# EasyEDA Pro project ProPrj_KrabbyUno - v0.2_2026-05-19.epro, board PCB1
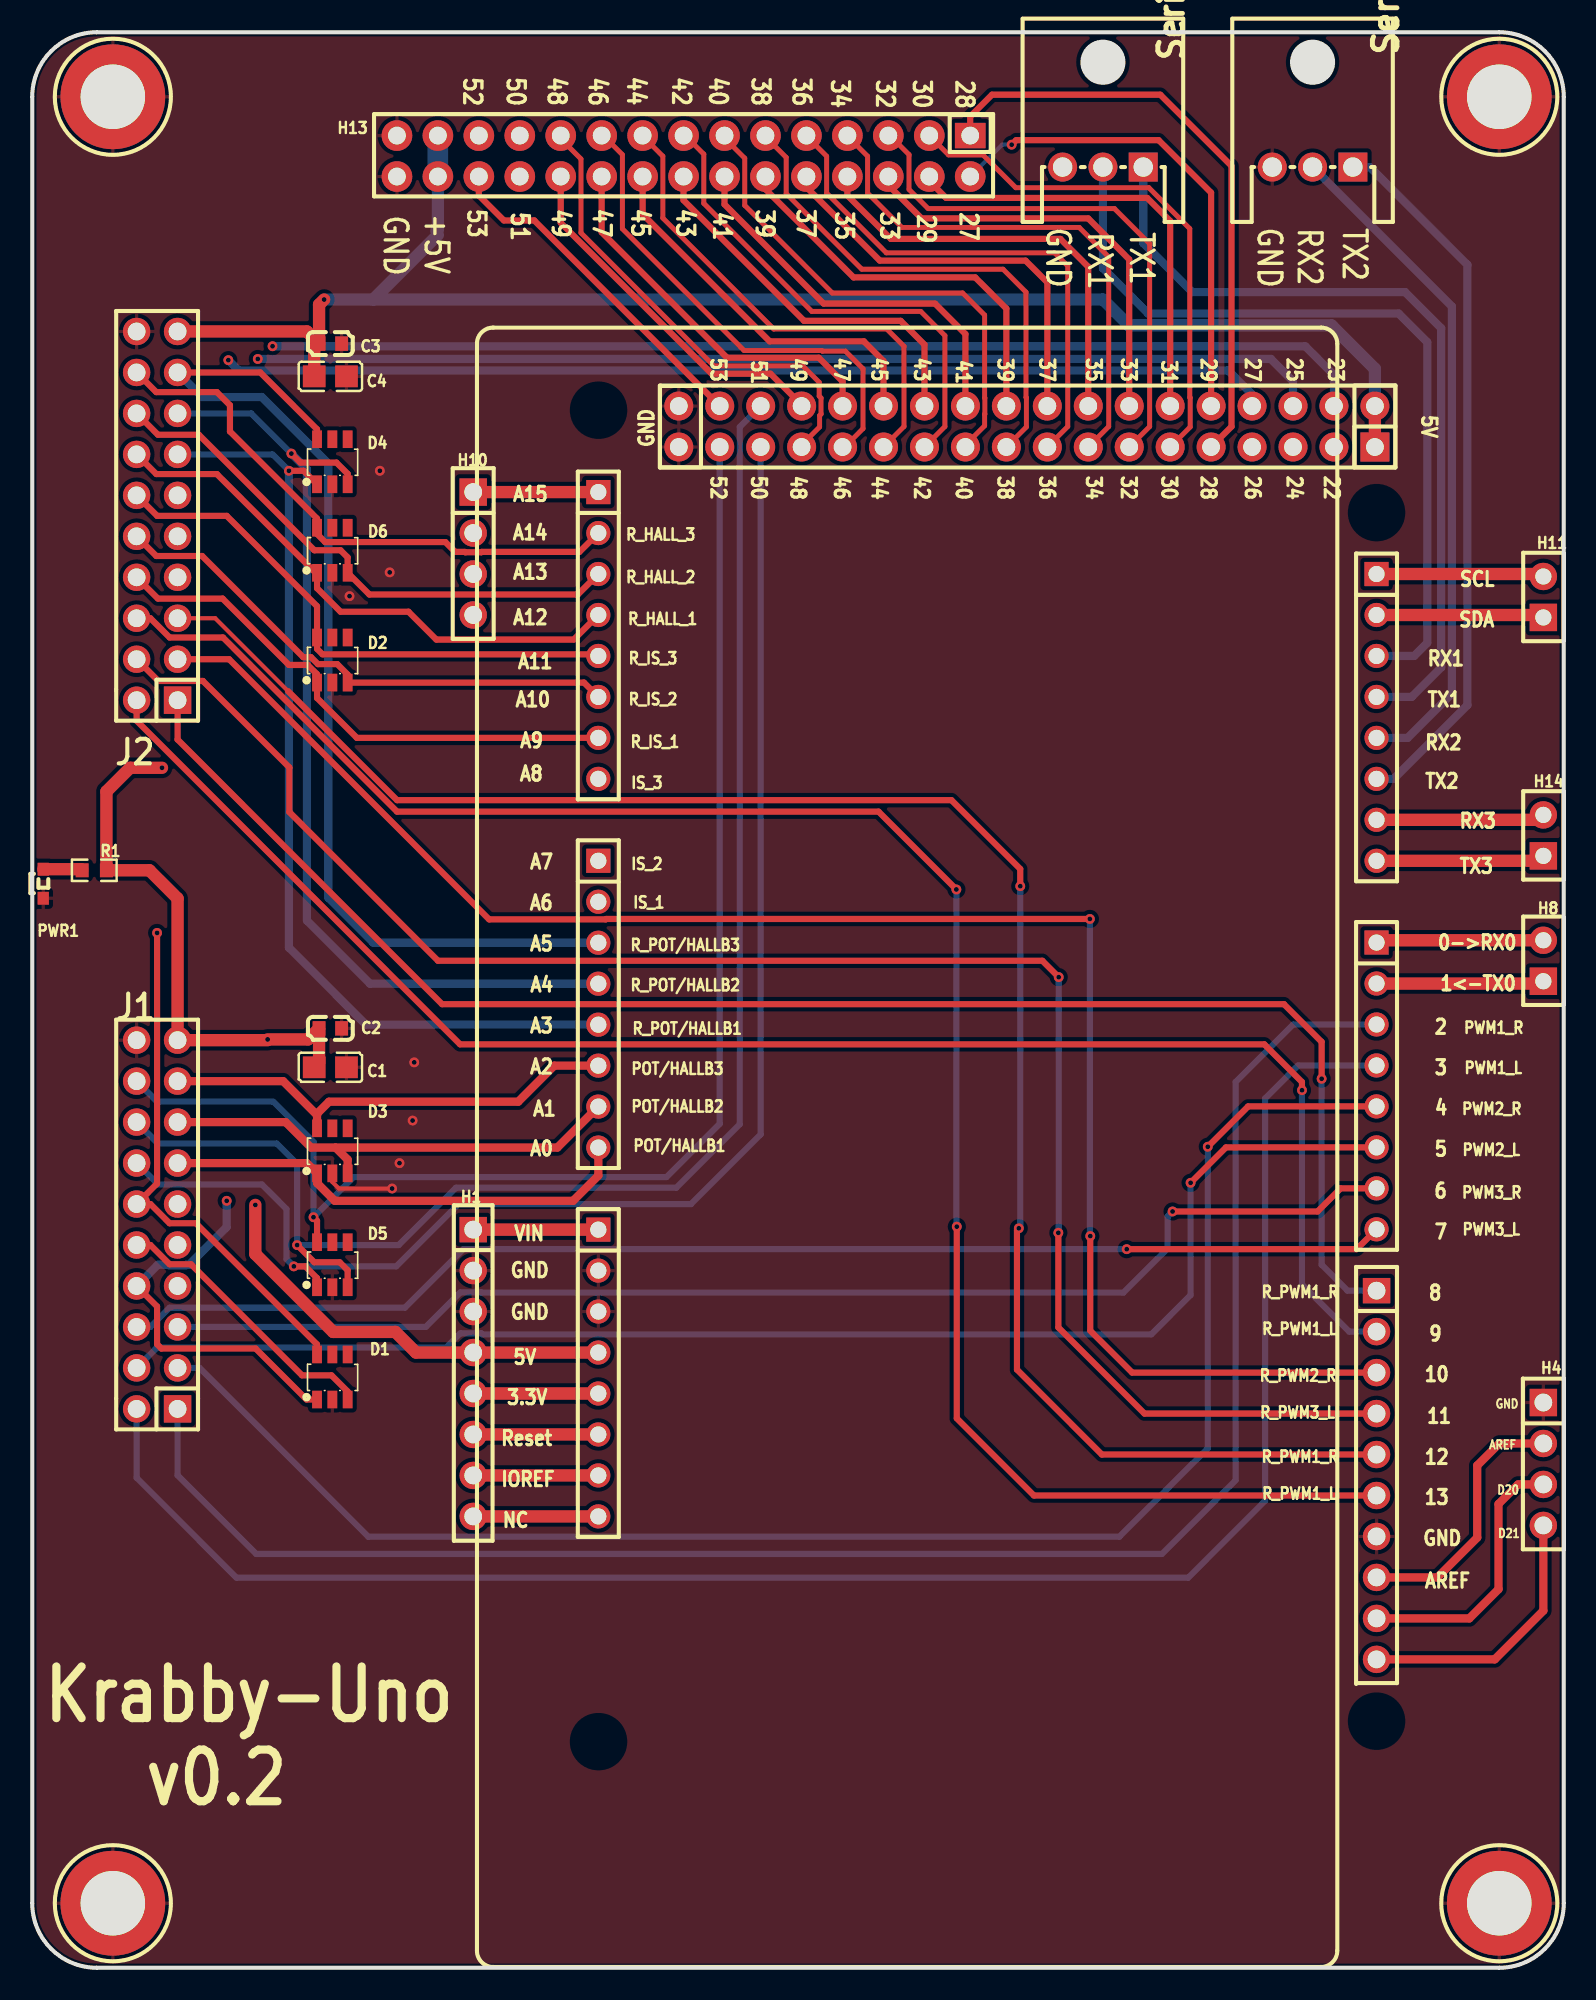
[diagram p6: board, top side]
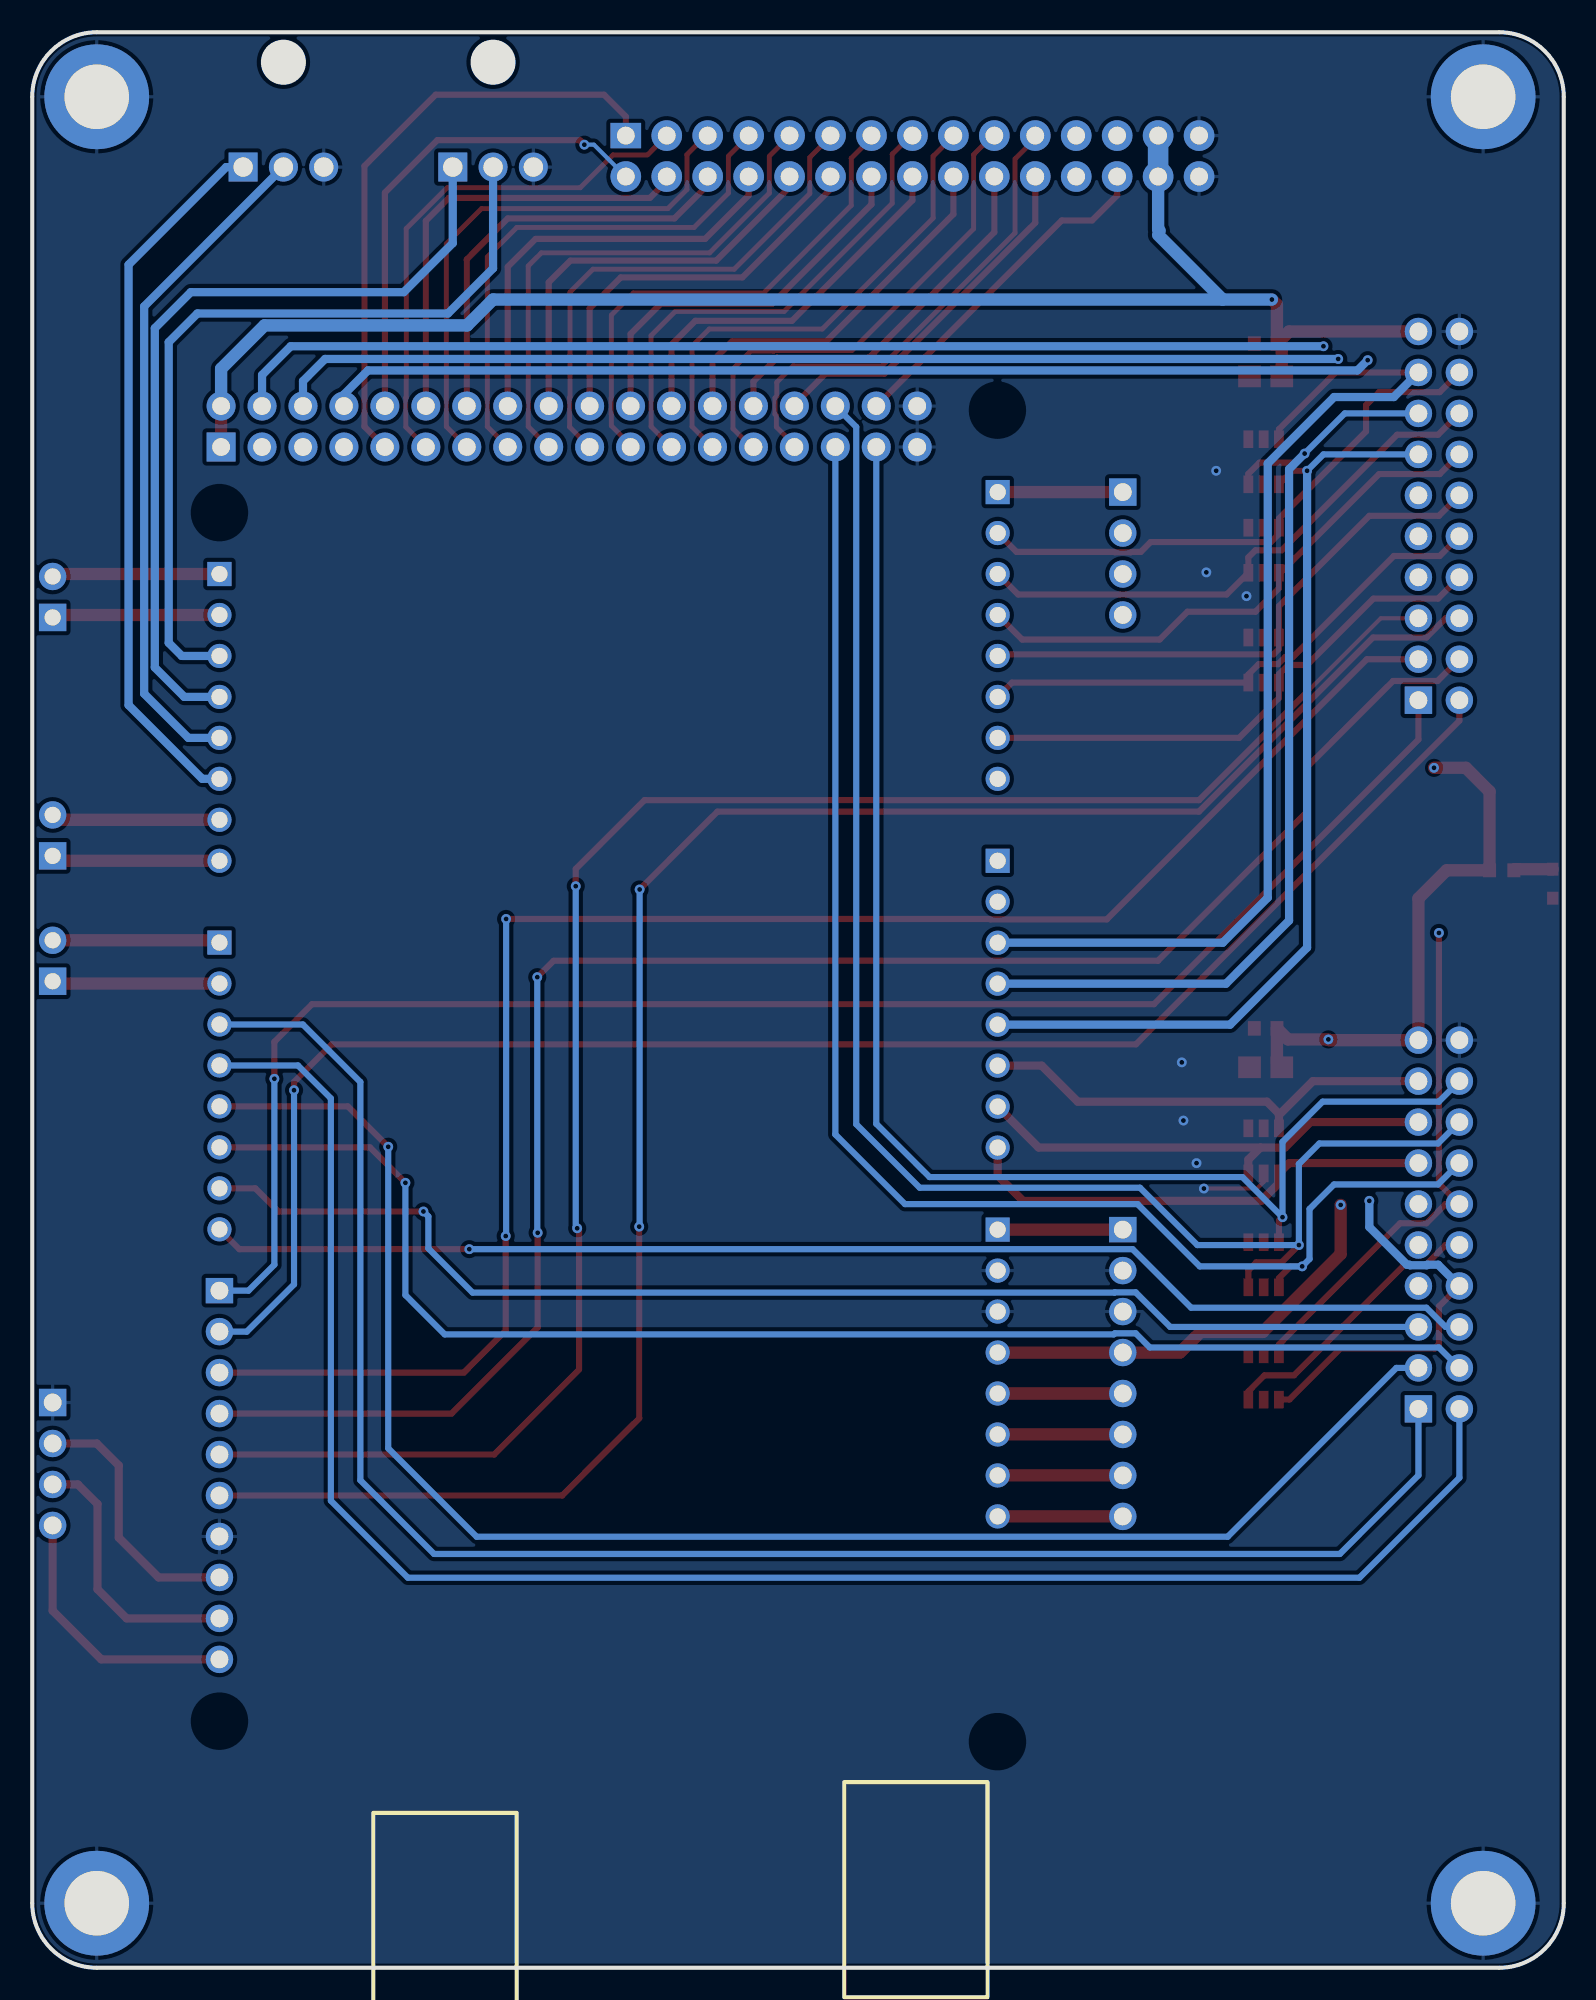
[diagram p7: board, bottom side, seen from below]

Outline 95 x 120 mm; copper layers: Top Layer, Inner1, Inner2, Bottom Layer. Coordinates in mm from the lower left corner of the outline.
Outline path: 0,116 0,4 arc(1.17,1.17) 4,0 91,0 arc(93.83,1.17) 95,4 95,116 arc(93.83,118.83) 91,120 4,120 arc(1.17,118.83) 0,116
Stack: Top Layer 0.035mm Outer layer thickness 1oz / Dielectric1 0.2104mm 7628 RC49% 8.6mil / Inner1 0.0152mm Inner layer thickness / Dielectric2 1.065mm 1.1mm H/HOZ Copper / Inner2 0.0152mm Inner layer thickness / Dielectric3 0.2104mm 7628 RC49% 8.6mil / Bottom Layer 0.035mm Outer layer thickness 1oz

## Design rules (mm)
template: JLCPCB Capability(Two Layers Board)
spacing copperThickness1oz (default): track to track 0.102, other pairs 0.152 to 0.3
spacing copperThickness2oz: track to track 0.203, other pairs 0.152 to 0.3
track width copperThickness1oz (default): min 0.127, default 0.254, max 2.54
track width copperThickness2oz: min 0.203, default 0.254, max 2.54
differential pair differentialPair (default): width min 0.127, default 0.254, max 2.54; gap min 0.152, default 0.152
via viaSize (default): diameter min 0.5, default 0.61, max 10; hole min 0.3, default 0.305, max 6.3

## Placement (name value [footprint] x y rotation side)
C1  4.7uF  [C0805]  18.49 55.83 180 top
C2  100nF  [C0603]  18.49 58.24 0 top
C3  100nF  [C0603]  18.49 100.7 0 top
C4  4.7uF  [C0805]  18.49 98.67 180 top
D1  PESD5V0S5UD,115  [SC-74-6_L3.0-W1.5-P0.95-LS2.8-BL]  18.62 36.63 0 top
D2  PESD5V0S5UD,115  [SC-74-6_L3.0-W1.5-P0.95-LS2.8-BL]  18.62 81.08 0 top
D3  PESD5V0S5UD,115  [SC-74-6_L3.0-W1.5-P0.95-LS2.8-BL]  18.62 50.65 0 top
D4  PESD5V0S5UD,115  [SC-74-6_L3.0-W1.5-P0.95-LS2.8-BL]  18.62 93.37 0 top
D5  PESD5V0S5UD,115  [SC-74-6_L3.0-W1.5-P0.95-LS2.8-BL]  18.62 43.59 0 top
D6  PESD5V0S5UD,115  [SC-74-6_L3.0-W1.5-P0.95-LS2.8-BL]  18.62 87.88 0 top
H1  PM254-1-08-Z-8.5  [HDR-TH_8P-P2.54-V-F]  27.35 36.87 270 top
H2  PZ254V-11-08P  [HDR-TH_8P-P2.54-V-M]  35.11 36.87 270 top
H3  PZ254V-11-10P  [HDR-TH_10P-P2.54-V-M]  83.39 30.55 270 top
H4  PM254-1-04-Z-8.5  [HDR-TH_4P-P2.54-V-F]  93.73 31.23 270 top
H5  PZ254V-11-08P  [HDR-TH_8P-P2.54-V-M]  35.11 59.74 270 top
H6  PZ254V-11-08P  [HDR-TH_8P-P2.54-V-M]  83.39 54.67 270 top
H7  PZ254V-11-08P  [HDR-TH_8P-P2.54-V-M]  35.11 82.6 270 top
H8  PM254-1-02-Z-8.5  [HDR-TH_2P-P2.54-V-F]  93.73 62.43 90 top
H9  PZ254V-11-08P  [HDR-TH_8P-P2.54-V-M]  83.39 77.52 270 top
H10  PM254-1-04-Z-8.5  [HDR-TH_4P-P2.54-V-F]  27.35 87.68 270 top
H11  PM254-1-02-Z-8.5  [HDR-TH_2P-P2.54-V-F]  93.73 84.99 90 top
H12  PZ254-2-18-Z-8.5  [HDR-TH_36P-P2.54-V-M-R2-C18-S2.54]  61.69 95.56 0 top
H13  HC-PM254-8.5H-2x15PZ  [HDR-TH_30P-P2.54-V-F-R2-C15-S2.54]  40.4 112.32 180 top
H14  PM254-1-02-Z-8.5  [HDR-TH_2P-P2.54-V-F]  93.73 70.21 90 top
J1  PZ254V-12-20P  [HDR-TH_20P-P2.54-V-M-R2-C10-S2.54]  7.75 46.08 90 top
J2  PZ254V-12-20P  [HDR-TH_20P-P2.54-V-M-R2-C10-S2.54]  7.75 90.02 90 top
M1  SMTSO2025CTJ  [SMD-1_BD6.2-D3.6]  5 116 270 top
M2  SMTSO2025CTJ  [SMD-1_BD6.2-D3.6]  5 4 270 top
M3  SMTSO2025CTJ  [SMD-1_BD6.2-D3.6]  91 116 270 top
M4  SMTSO2025CTJ  [SMD-1_BD6.2-D3.6]  91 4 270 top
PWR1  LTST-S270TGKT  [LED-SMD_L1.7-W0.6-RD_GREEN]  0.68 67.21 90 top
R1  4.7K  [R0603]  3.85 68.04 180 top
Serial_1  S03B-XASK-1(LF)(SN)  [CONN-TH_S03B-XASK-1]  66.41 111.64 180 top
Serial_2  S03B-XASK-1(LF)(SN)  [CONN-TH_S03B-XASK-1]  79.42 111.64 180 top

## Footprints (pads in the part's own frame, mm; a bottom-side part is the same pattern mirrored in y, then rotated)
C0603
  rect 0.8x0.9 smd: 1(-0.7,0) 2(0.7,0)
C0805
  rect 1.41x1.35 smd: 1(-1,0) 2(1,0)
CONN-TH_S03B-XASK-1
  rect 1.8x1.8 hole 1.2: 1(-2.5,0)
  round 1.8 hole 1.2: 2(0,0) 3(2.5,0)
HDR-TH_2P-P2.54-V-F
  rect 1.7x1.7 hole 1: 1(-1.27,0)
  round 1.7 hole 1: 2(1.27,0)
HDR-TH_4P-P2.54-V-F
  rect 1.7x1.7 hole 1.1: 1(-3.81,0)
  round 1.7 hole 1.1: 2(-1.27,0) 3(1.27,0) 4(3.81,0)
HDR-TH_8P-P2.54-V-F
  rect 1.575x1.7 hole 1.1: 1(-8.89,0)
  round 1.7 hole 1.1: 2(-6.35,0) 3(-3.81,0) 4(-1.27,0) 5(1.27,0) 6(3.81,0) 7(6.35,0) 8(8.89,0)
HDR-TH_8P-P2.54-V-M
  rect 1.5x1.5 hole 1: 1(-8.89,0)
  round 1.5 hole 1: 2(-6.35,0) 3(-3.81,0) 4(-1.27,0) 5(1.27,0) 6(3.81,0) 7(6.35,0) 8(8.89,0)
HDR-TH_10P-P2.54-V-M
  rect 1.575x1.7 hole 1.1: 1(-11.43,0)
  round 1.7 hole 1.1: 2(-8.89,0) 3(-6.35,0) 4(-3.81,0) 5(-1.27,0) 6(1.27,0) 7(3.81,0) 8(6.35,0) 9(8.89,0) 10(11.43,0)
HDR-TH_20P-P2.54-V-M-R2-C10-S2.54
  rect 1.7x1.7 hole 1.1: 1(-11.43,-1.27)
  round 1.7 hole 1.1: 2(-11.43,1.27) 3(-8.89,-1.27) 4(-8.89,1.27) 5(-6.35,-1.27) 6(-6.35,1.27) 7(-3.81,-1.27) 8(-3.81,1.27) 9(-1.27,-1.27) 10(-1.27,1.27) 11(1.27,-1.27) 12(1.27,1.27) 13(3.81,-1.27) 14(3.81,1.27) 15(6.35,-1.27) 16(6.35,1.27) 17(8.89,-1.27) 18(8.89,1.27) 19(11.43,-1.27) 20(11.43,1.27)
HDR-TH_30P-P2.54-V-F-R2-C15-S2.54
  rect 1.9x1.575 hole 1.1: 1(-17.78,-1.27)
  round 1.9 hole 1.1: 2(-17.78,1.27) 3(-15.24,-1.27) 4(-15.24,1.27) 5(-12.7,-1.27) 6(-12.7,1.27) 7(-10.16,-1.27) 8(-10.16,1.27) 9(-7.62,-1.27) 10(-7.62,1.27) 11(-5.08,-1.27) 12(-5.08,1.27) 13(-2.54,-1.27) 14(-2.54,1.27) 15(0,-1.27) 16(0,1.27) 17(2.54,-1.27) 18(2.54,1.27) 19(5.08,-1.27) 20(5.08,1.27) 21(7.62,-1.27) 22(7.62,1.27) 23(10.16,-1.27) 24(10.16,1.27) 25(12.7,-1.27) 26(12.7,1.27) 27(15.24,-1.27) 28(15.24,1.27) 29(17.78,-1.27) 30(17.78,1.27)
HDR-TH_36P-P2.54-V-M-R2-C18-S2.54
  rect 1.8x1.8 hole 1.1: 1(21.59,-1.27)
  round 1.8 hole 1.1: 2(21.59,1.27) 3(19.05,-1.27) 4(19.05,1.27) 5(16.51,-1.27) 6(16.51,1.27) 7(13.97,-1.27) 8(13.97,1.27) 9(11.43,-1.27) 10(11.43,1.27) 11(8.89,-1.27) 12(8.89,1.27) 13(6.35,-1.27) 14(6.35,1.27) 15(3.81,-1.27) 16(3.81,1.27) 17(1.27,-1.27) 18(1.27,1.27) 19(-1.27,-1.27) 20(-1.27,1.27) 21(-3.81,-1.27) 22(-3.81,1.27) 23(-6.35,-1.27) 24(-6.35,1.27) 25(-8.89,-1.27) 26(-8.89,1.27) 27(-11.43,-1.27) 28(-11.43,1.27) 29(-13.97,-1.27) 30(-13.97,1.27) 31(-16.51,-1.27) 32(-16.51,1.27) 33(-19.05,-1.27) 34(-19.05,1.27) 35(-21.59,-1.27) 36(-21.59,1.27)
LED-SMD_L1.7-W0.6-RD_GREEN
  rect 0.8x0.7 smd: 1(-0.9,0) 2(0.9,0)
R0603
  rect 0.806x0.864 smd: 1(-0.753,0) 2(0.753,0)
SC-74-6_L3.0-W1.5-P0.95-LS2.8-BL
  rect 0.61x1.092 smd: 1(-0.95,-1.397) 2(0,-1.397) 3(0.95,-1.397) 4(0.95,1.397) 5(0,1.397) 6(-0.95,1.397)
SMD-1_BD6.2-D3.6
  round 6.5 hole 4: 1(0,0)

## Nets
As in the schematic.

Pads without a net: D1 4 5; D2 4 5; D3 4 5; D4 4 5; D5 4 5; D6 4 5; H10 2 3 4; H13 23 24 25

## Via types
v1: diameter 0.61, hole 0.305, Top Layer to Bottom Layer, 36 vias

## Routing (per net, layer and track width the routed paths; a pad name or vN(x,y) marks a point on that pad's centre or on a via; arc(x,y) is an arc through that point)
+5V: length 206.6
  Top Layer w0.762: J2.19 17.04,101.45 C3.1 ; H12.1 H12.2 ; v1(8.05,74.4) 6.07,74.4 4.6,72.93 R1.1 7.27,68.04 9.02,66.3 J1.19 14.6,57.51 ; C3.1 17.49,100.4 C4.2 ; C3.1 17.79,103.11 v1(18.11,103.43) ; C1.2 17.79,56.13 C2.1 17.11,57.56 v1(14.6,57.56) ; v1(13.84,47.3) 13.84,44.25 18.67,39.42 22.53,39.42 23.8,38.14 H1.4 H2.4
  Inner2 w0.762: v1(18.11,103.43) 17.19,102.51 17.19,76.71 15.47,74.98 8.63,74.98 v1(8.05,74.4) ; v1(14.6,57.56) 13.84,56.79 v1(13.84,47.3)
  Bottom Layer w0.762: 21.15,103.43 25.16,107.44 ; 21.15,103.43 v1(18.11,103.43) ; 21.15,103.43 66.42,103.43 68.02,101.83 80.59,101.83 83.28,99.13 H12.2 ; H13.28 25.16,107.79 25.07,107.7
  Bottom Layer w1.27: H13.28 H13.27
GND: length 4.4
  Top Layer w0.254: v1(22.32,48.31) 19.02,48.31 18.62,48.72 18.62,49.25
  vias: v1(19.68,85.04) v1(21.56,92.81) v1(22.17,86.51) v1(22.78,49.89) v1(23.59,52.53) v1(23.69,56.13)
AREF: length 16.4
  Top Layer w0.508: H4.2 91,32.5 89.63,31.14 89.63,26.67 87.16,24.2 H3.8
D20: length 16.9
  Top Layer w0.508: H3.9 89.14,21.66 90.95,23.47 90.95,28.75 92.16,29.96 H4.3
D21: length 16.9
  Top Layer w0.508: H4.4 93.73,22.14 90.72,19.12 H3.10
EN1: length 113.4
  Inner2 w0.381: H12.3 80.75,59.87 68.17,47.3 26.39,47.3 21.36,42.27 J1.7
EN2: length 111.3
  Inner2 w0.381: H12.5 78.21,60.12 66.39,48.31 26.03,48.31 20.55,42.82 11,42.82 J1.9
EN3: length 107.5
  Inner2 w0.381: H12.7 75.97,93.98 75.97,60.55 64.33,48.92 25.62,48.92 24.05,47.35 16.63,47.35 15.21,45.92 10.44,45.92 J1.11
HALLA1: length 91.5
  Top Layer w0.381: D5.1 17.67,42.76 16.94,43.48 v1(16.23,43.48)
  Bottom Layer w0.381: H12.31 45.19,51.67 40.87,47.35 26.44,47.35 22.58,43.48 v1(16.23,43.48) 15.77,43.94 15.77,47.04 14.25,48.56 7.8,48.56 J1.14
HALLA2: length 96.5
  Top Layer w0.381: D5.3 19.57,43.24 19.07,43.74 17.5,43.74 v1(16.43,44.81)
  Bottom Layer w0.381: H12.32 43.89,95.53 43.89,52.3 39.95,48.36 26.28,48.36 22.73,44.81 v1(16.43,44.81) 16.43,49.83 15.16,51.11 7.8,51.11 J1.16
HALLA3: length 88.4
  Top Layer w0.381: D5.6 17.67,46.31 v1(17.45,46.53)
  Bottom Layer w0.381: H12.33 42.65,52.33 39.34,49.02 19.94,49.02 v1(17.45,46.53) 17.45,51.21 14.96,53.7 7.75,53.7 J1.18
IS1: length 64
  Top Layer w0.381: J1.8 7.74,41 7.74,38.66 8.01,38.39 13.85,38.39 17.01,35.23 D1.1
  Inner2 w0.508: v1(12.06,47.55) 12.06,62.99 15.16,66.09 H5.2
  Bottom Layer w0.508: v1(12.06,47.55) 12.06,45.92 9.72,43.59 9.57,43.59 9.53,43.55 8.49,43.55 8.46,43.59 7.79,43.59 J1.8
IS2: length 65.6
  Top Layer w0.381: J1.10 7.33,44.81 8.52,43.62 9.85,43.62 16.73,36.73 18.56,36.73 19.57,35.73 D1.3
  Inner2 w0.508: J1.10 7.74,46.08 7.74,62.69 13.69,68.63 H5.1
IS3: length 67.9
  Top Layer w0.381: D1.6 17.67,38.64 10.15,46.16 8.52,46.16 7.33,47.35 J1.12 7.74,48.62 v1(7.74,64.16)
  Inner2 w0.508: v1(7.74,64.16) 7.74,70.66 10.79,73.71 H7.8
POT/HALLB1: length 29.8
  Top Layer w0.508: J1.13 17.03,49.89 17.67,49.25 17.67,48.65 18.77,47.55 33.55,47.55 35.11,49.11 H5.8
POT/HALLB2: length 29.7
  Top Layer w0.508: H5.7 32.57,50.85 18.82,50.85 ; 18.82,50.85 17.29,50.85 15.72,52.43 J1.15 ; 18.82,50.85 19.57,50.1 19.57,49.25
POT/HALLB3: length 29.1
  Top Layer w0.508: H5.6 32.38,55.93 30.15,53.7 18.41,53.7 17.67,52.95 17.67,52.87 ; 17.67,52.87 15.56,54.97 J1.17 ; 17.67,52.87 D3.6
PWM1_L: length 111.5
  Bottom Layer w0.381: J1.2 6.47,30.38 12.67,24.18 71.7,24.18 76.48,28.96 76.48,53.9 78.52,55.94 H6.4
PWM1_R: length 108.6
  Bottom Layer w0.381: H6.3 78.21,58.48 74.65,54.92 74.65,30.23 70.07,25.65 13.89,25.65 9.02,30.53 J1.1
PWM2_L: length 86.7
  Top Layer w0.381: H6.6 74.05,50.86 v1(71.85,48.67)
  Bottom Layer w0.381: J1.4 7.74,38.46 25.68,38.46 26.56,39.34 27.85,39.34 27.91,39.27 69.41,39.27 71.85,41.71 v1(71.85,48.67)
PWM2_R: length 100.7
  Top Layer w0.381: H6.5 75.42,53.4 v1(72.92,50.9)
  Bottom Layer w0.381: v1(72.92,50.9) 72.92,32.21 67.43,26.72 20.85,26.72 10.38,37.19 J1.3
PWM3_L: length 79.4
  Top Layer w0.381: v1(67.89,44.55) 82.16,44.55 H6.8
  Bottom Layer w0.381: J1.6 7.33,39.73 8.52,40.92 23.11,40.92 26.74,44.55 v1(67.89,44.55)
PWM3_R: length 79.1
  Top Layer w0.381: H6.7 81.16,48.32 79.73,46.89 v1(70.74,46.89)
  Bottom Layer w0.381: J1.5 24.41,39.73 26.56,41.88 27.85,41.88 27.86,41.86 67.69,41.86 70.43,44.6 70.43,46.58 v1(70.74,46.89)
R_EN1: length 87.4
  Inner2 w0.508: v1(14.91,100.53) 14.91,88.54 12.57,86.21 J2.7
  Bottom Layer w0.508: H12.4 80.75,98.75 78.97,100.53 v1(14.91,100.53)
R_EN2: length 81.3
  Inner2 w0.508: J2.9 12.32,88.75 13.99,90.42 v1(13.99,99.75)
  Bottom Layer w0.508: H12.6 78.21,98.37 76.83,99.75 v1(13.99,99.75)
R_EN3: length 76.1
  Inner2 w0.508: J2.11 11.25,91.29 12.16,92.2 v1(12.16,99.67)
  Bottom Layer w0.508: H12.8 75.66,97.54 74.18,99.03 12.8,99.03 v1(12.16,99.67)
R_HALLA1: length 34.6
  Top Layer w0.381: J2.14 7.69,92.61 11.45,92.61 17.57,86.49 D6.1 17.67,85.53 19.12,84.07 23.34,84.07 25.07,82.35 33.59,82.35 H7.4
R_HALLA2: length 34.4
  Top Layer w0.381: J2.16 7.8,95.05 10.33,95.05 17.5,87.88 19.12,87.88 19.57,87.44 D6.3 20.91,85.14 33.84,85.14 H7.3
R_HALLA3: length 35.3
  Top Layer w0.381: H7.2 33.94,87.78 27.87,87.78 27.85,87.76 26.86,87.76 26.84,87.78 26.23,87.78 25.62,88.39 18.17,88.39 17.67,88.9 D6.6 17.67,89.85 12.26,95.25 12.26,96.88 11.45,97.69 7.69,97.69 J2.18
R_IS1: length 33.6
  Top Layer w0.381: H7.7 20.14,76.25 17.67,78.72 D2.1 17.67,80.2 17.09,80.77 15.92,80.77 11.81,84.89 7.8,84.89 J2.8
R_IS2: length 33.1
  Top Layer w0.381: H7.6 34.22,79.68 D2.3 19.57,80.18 18.92,80.82 17.72,80.82 17.29,81.25 16.81,81.25 10.54,87.53 7.69,87.53 J2.10
R_IS3: length 34.3
  Top Layer w0.381: H7.5 35.01,81.43 18,81.43 17.67,81.77 D2.6 17.67,84.41 12.06,90.02 7.75,90.02 J2.12
R_POT/HALLB1: length 60.2
  Top Layer w0.381: D4.1 16.83,92.81 v1(15.92,92.81)
  Bottom Layer w0.381: J2.13 14.91,93.83 v1(15.92,92.81)
  Bottom Layer w0.508: H5.5 20.7,58.47 15.92,63.25 v1(15.92,92.81)
R_POT/HALLB2: length 61.8
  Top Layer w0.381: v1(16.07,93.88) 16.63,93.32 18.87,93.32 19.57,92.62 D4.3
  Bottom Layer w0.381: v1(16.07,93.88) 13.58,96.37 J2.15
  Bottom Layer w0.508: H5.4 20.95,61.01 17.04,64.92 17.04,92.91 v1(16.07,93.88)
R_POT/HALLB3: length 67.2
  Top Layer w0.381: J2.17 14.14,98.91 17.67,95.39 D4.6
  Bottom Layer w0.508: J2.17 10.54,97.38 14.25,97.38 18.36,93.27 18.36,66.34 21.15,63.55 H5.3
R_PWM1_L: length 101.2
  Top Layer w0.381: J2.2 6.47,77.32 26.54,57.25 76.43,57.25 78.76,54.92 v1(78.76,54.41)
  Bottom Layer w0.381: v1(78.76,54.41) 78.76,42.37 81.69,39.44 H3.2
R_PWM1_R: length 99.1
  Top Layer w0.381: v1(79.98,55.12) 79.98,57.4 77.64,59.74 25.42,59.74 9.02,76.15 J2.1
  Bottom Layer w0.381: H3.1 81.59,41.98 79.98,43.59 v1(79.98,55.12)
R_PWM2_L: length 110.7
  Top Layer w0.381: J2.4 7.82,79.78 10.59,79.78 15.95,74.42 15.95,71.66 25.17,62.43 62.66,62.43 v1(63.67,61.42) ; v1(63.65,45.57) 63.65,39.7 68.99,34.36 H3.4
  Bottom Layer w0.381: v1(63.67,61.42) 63.67,45.59 v1(63.65,45.57)
R_PWM2_R: length 107.7
  Top Layer w0.381: J2.3 12.21,81.13 28.34,65 35.57,65 35.59,65.02 v1(65.6,65.02) ; v1(65.63,45.36) 65.63,39.5 68.23,36.9 H3.3
  Bottom Layer w0.381: v1(65.63,45.36) 65.6,45.39 v1(65.6,65.02)
R_PWM3_L: length 118.6
  Top Layer w0.381: J2.6 7.33,83.67 8.52,82.48 11.83,82.48 22.63,71.68 52.5,71.68 v1(57.32,66.85) ; v1(57.35,45.95) 57.35,34.06 62.13,29.28 H3.6
  Bottom Layer w0.381: v1(57.35,45.95) 57.32,45.97 v1(57.32,66.85)
R_PWM3_R: length 114.3
  Top Layer w0.254: 15.87,79.15 11.35,83.67 J2.5
  Top Layer w0.381: H3.5 66.35,31.82 61.08,37.08 61.08,45.73 v1(61.2,45.85) ; 15.87,79.15 22.63,72.39 57.02,72.39 61.29,68.12 v1(61.29,67.06)
  Bottom Layer w0.381: v1(61.29,67.06) 61.29,45.94 v1(61.2,45.85)
RX1: length 50.4
  Bottom Layer w0.508: Serial_1.2 66.41,105.36 69.21,102.56 84.76,102.56 86.53,100.79 86.53,82.14 85.72,81.33 H9.3
RX2: length 42
  Bottom Layer w0.508: H9.5 85.31,76.25 88.06,78.99 88.06,103 Serial_2.2
RX3: length 10.5
  Top Layer w0.762: H9.7 93.43,71.17 H14.2
SCL: length 10.4
  Top Layer w0.762: H11.2 93.58,86.41 H9.1
SDA: length 10.4
  Top Layer w0.762: H11.1 93.58,83.87 H9.2
TX1: length 51.2
  Bottom Layer w0.508: Serial_1.1 68.91,106.93 71.95,103.89 85.16,103.89 87.4,101.65 87.4,80.62 85.57,78.79 H9.4
TX2: length 44.4
  Bottom Layer w0.508: Serial_2.1 82.97,111.64 89.02,105.59 89.02,78.28 84.45,73.71 H9.6
TX3: length 10.5
  Top Layer w0.762: H9.8 93.43,68.63 H14.1
$1N20121: length 2.4
  Top Layer w0.762: PWR1.2 3.03,68.11 R1.2
$1N20679: length 10.4
  Top Layer w0.762: H6.1 83.53,63.7 H8.2
$1N20691: length 10.4
  Top Layer w0.762: H6.2 93.59,61.02 H8.1
$1N21733: length 7.8
  Top Layer w0.762: H7.1 H10.1
$1N21820: length 7.8
  Top Layer w0.762: 35.11,35.6 27.35,35.6
$1N21825: length 7.8
  Top Layer w0.762: H2.8 H1.8
$1N21830: length 7.8
  Top Layer w0.762: H2.7 H1.7
$1N21836: length 7.8
  Top Layer w0.762: H2.6 H1.6
$1N23731: length 7.8
  Top Layer w0.762: 35.11,45.76 27.35,45.76
$1N24030: length 32.6
  Top Layer w0.305: 48.02,113.57 49.28,112.31 49.28,110.03 52.98,106.32 63.42,106.32 64.23,105.51 64.23,95.55 H12.17
$1N24036: length 25.7
  Top Layer w0.381: H13.10 48.02,110.39 52.57,105.84 61.62,105.84 62.97,104.49 H12.18
$1N24042: length 31.6
  Top Layer w0.305: 45.48,113.53 46.77,112.24 46.77,110 51.46,105.31 60.22,105.31 61.64,103.89 61.64,97.37 61.67,97.34 61.67,95.53 H12.19
$1N24048: length 24.8
  Top Layer w0.381: H12.20 60.43,102.87 58.49,104.8 50.95,104.8 45.48,110.27 H13.12
$1N24054: length 31.2
  Top Layer w0.305: H12.21 57.88,94.41 59.08,95.6 59.08,96.31 59.09,96.33 59.09,97.32 59.08,97.34 59.08,102.46 57.71,103.83 49.63,103.83 44.2,109.27 44.2,112.19 42.94,113.44 42.94,113.57
$1N24060: length 24.5
  Top Layer w0.381: H13.14 42.94,109.33 49.09,103.17 56,103.17 57.88,101.29 H12.22
$1N24066: length 30.6
  Top Layer w0.305: H12.23 56.61,95.55 56.61,101.19 55.11,102.69 48.36,102.69 41.66,109.39 41.66,112.44 40.5,113.59 H13.15
$1N24072: length 23.9
  Top Layer w0.381: H12.24 55.34,100.63 53.87,102.11 47.88,102.11 40.4,109.58 H13.16
$1N24078: length 30.6
  Top Layer w0.305: H12.25 54.07,95.55 54.07,100.53 53.01,101.6 46,101.6 39.12,108.48 39.12,112.31 37.86,113.57
$1N24084: length 23.8
  Top Layer w0.381: H12.26 52.81,99.62 51.58,100.84 45.74,100.84 37.86,108.72 H13.18
$1N24090: length 30.3
  Top Layer w0.305: H13.19 35.45,113.47 35.55,113.47 36.61,112.41 36.61,107.81 44.15,100.27 48.97,100.27 49.01,100.23 50.44,100.23 51.53,99.14 51.53,95.43 50.39,94.29 H12.27
$1N24096: length 23.8
  Top Layer w0.381: H13.20 35.32,107.6 43.1,99.82 48.79,99.82 50.26,98.35 H12.28
$1N24102: length 29.7
  Top Layer w0.305: H12.29 47.72,94.41 48.84,95.53 48.84,96.24 48.93,96.33 48.93,97.32 48.81,97.44 48.81,98.3 47.8,99.31 42.28,99.31 34.04,107.56 34.04,112.14 32.78,113.4 32.78,113.53
$1N24108: length 22.6
  Top Layer w0.381: H12.30 47.72,96.9 45.79,98.83 42.14,98.83 32.78,108.19 H13.22
$1N38352: length 37.7
  Top Layer w0.381: H12.9 74.39,95.55 74.39,111.71 69.97,116.13 59.53,116.13 58.18,114.78 H13.1
$1N38357: length 32.6
  Top Layer w0.305: H13.3 56.84,112.4 58.97,112.4 61.01,110.36 69.26,110.36 71.8,107.82 71.8,97.37 71.83,97.34 71.83,95.53 H12.11
$1N38366: length 33.4
  Top Layer w0.305: 53.1,113.7 54.39,112.41 54.39,110.25 55.57,109.07 67.13,109.07 69.31,106.88 69.31,95.55 H12.13
$1N38371: length 33
  Top Layer w0.305: 50.56,113.57 51.82,112.31 51.82,110.03 53.95,107.9 64.94,107.9 66.77,106.07 66.77,95.55 H12.15
$1N38377: length 26.6
  Top Layer w0.381: H13.8 50.56,109.89 53.26,107.19 63.78,107.19 65.5,105.46 H12.16
$1N38430: length 21.5
  Top Layer w0.381: H12.34 31.14,108.33 29.26,108.33 27.7,109.89 H13.26
$1N38639: length 30.5
  Top Layer w0.381: v1(60.75,113.03) 61.03,113.31 69.87,113.31 73.12,110.06 H12.10
  Bottom Layer w0.254: v1(60.75,113.03) 60.16,113.03 H13.2
$1N38644: length 27.7
  Top Layer w0.381: H13.4 55.64,110.78 56.69,109.73 69.16,109.73 70.59,108.3 H12.12
$1N38650: length 26.5
  Top Layer w0.381: H12.14 68.04,105.92 65.5,108.46 55.16,108.46 53.1,110.52 H13.6

## Copper pours and planes (outline as drawn; the poured copper is in the pictures)
GND on Top Layer: 0,130.18 100.08,130.18 100.08,0 0,0
GND on Bottom Layer: 0,130.18 100.08,130.18 100.08,0 0,0
GND on Inner1: 0,0 100.03,0 100.03,130 0,130
GND on Inner2: 0,130.15 100.03,130.15 100.03,0 0,0

## Text on the board
Top Silkscreen Layer: AREF | GND | D20 | D21 | R_HALL_3 | R_HALL_2 | R_HALL_1 | R_IS_3 | R_IS_2 | R_POT/HALLB3 | R_POT/HALLB2 | R_IS_1 | IS_3 | IS_2 | POT/HALLB3 | POT/HALLB2 | R_POT/HALLB1 | IS_1 | POT/HALLB1 | R_PWM2_R | R_PWM3_L | R_PWM1_R | R_PWM1_L | PWM2_R | PWM3_R | PWM2_L | PWM3_L | PWM1_R | PWM1_L | 53 | 52 | 51 | 50 | 49 | 48 | 47 | 46 | 45 | 44 | 43 | 42 | 41 | 40 | 39 | 38 | 37 | 36 | 35 | 34 | 33 | 32 | 31 | 30 | 29 | 28 | 27 | 26 | 25 | 24 | 22 | 23 | 5V | Reset | IOREF | NC | 3.3V | A14 | A15 | A13 | A12 | VIN | A10 | A11 | A8 | A9 | A6 | A7 | A5 | A3 | A2 | A0 | A4 | A1 | 10 | 12 | 13 | RX2 | TX2 | 11 | RX1 | TX1 | 8 | 9 | 6 | 2 | 3 | 5 | 7 | 4 | 0->RX0 | 1<-TX0 | SDA | RX3 | TX3 | SCL | +5V | Krabby-Uno / v0.2
